# EAGLE design HelloWorldEAther (EAGLE 7.7.0)
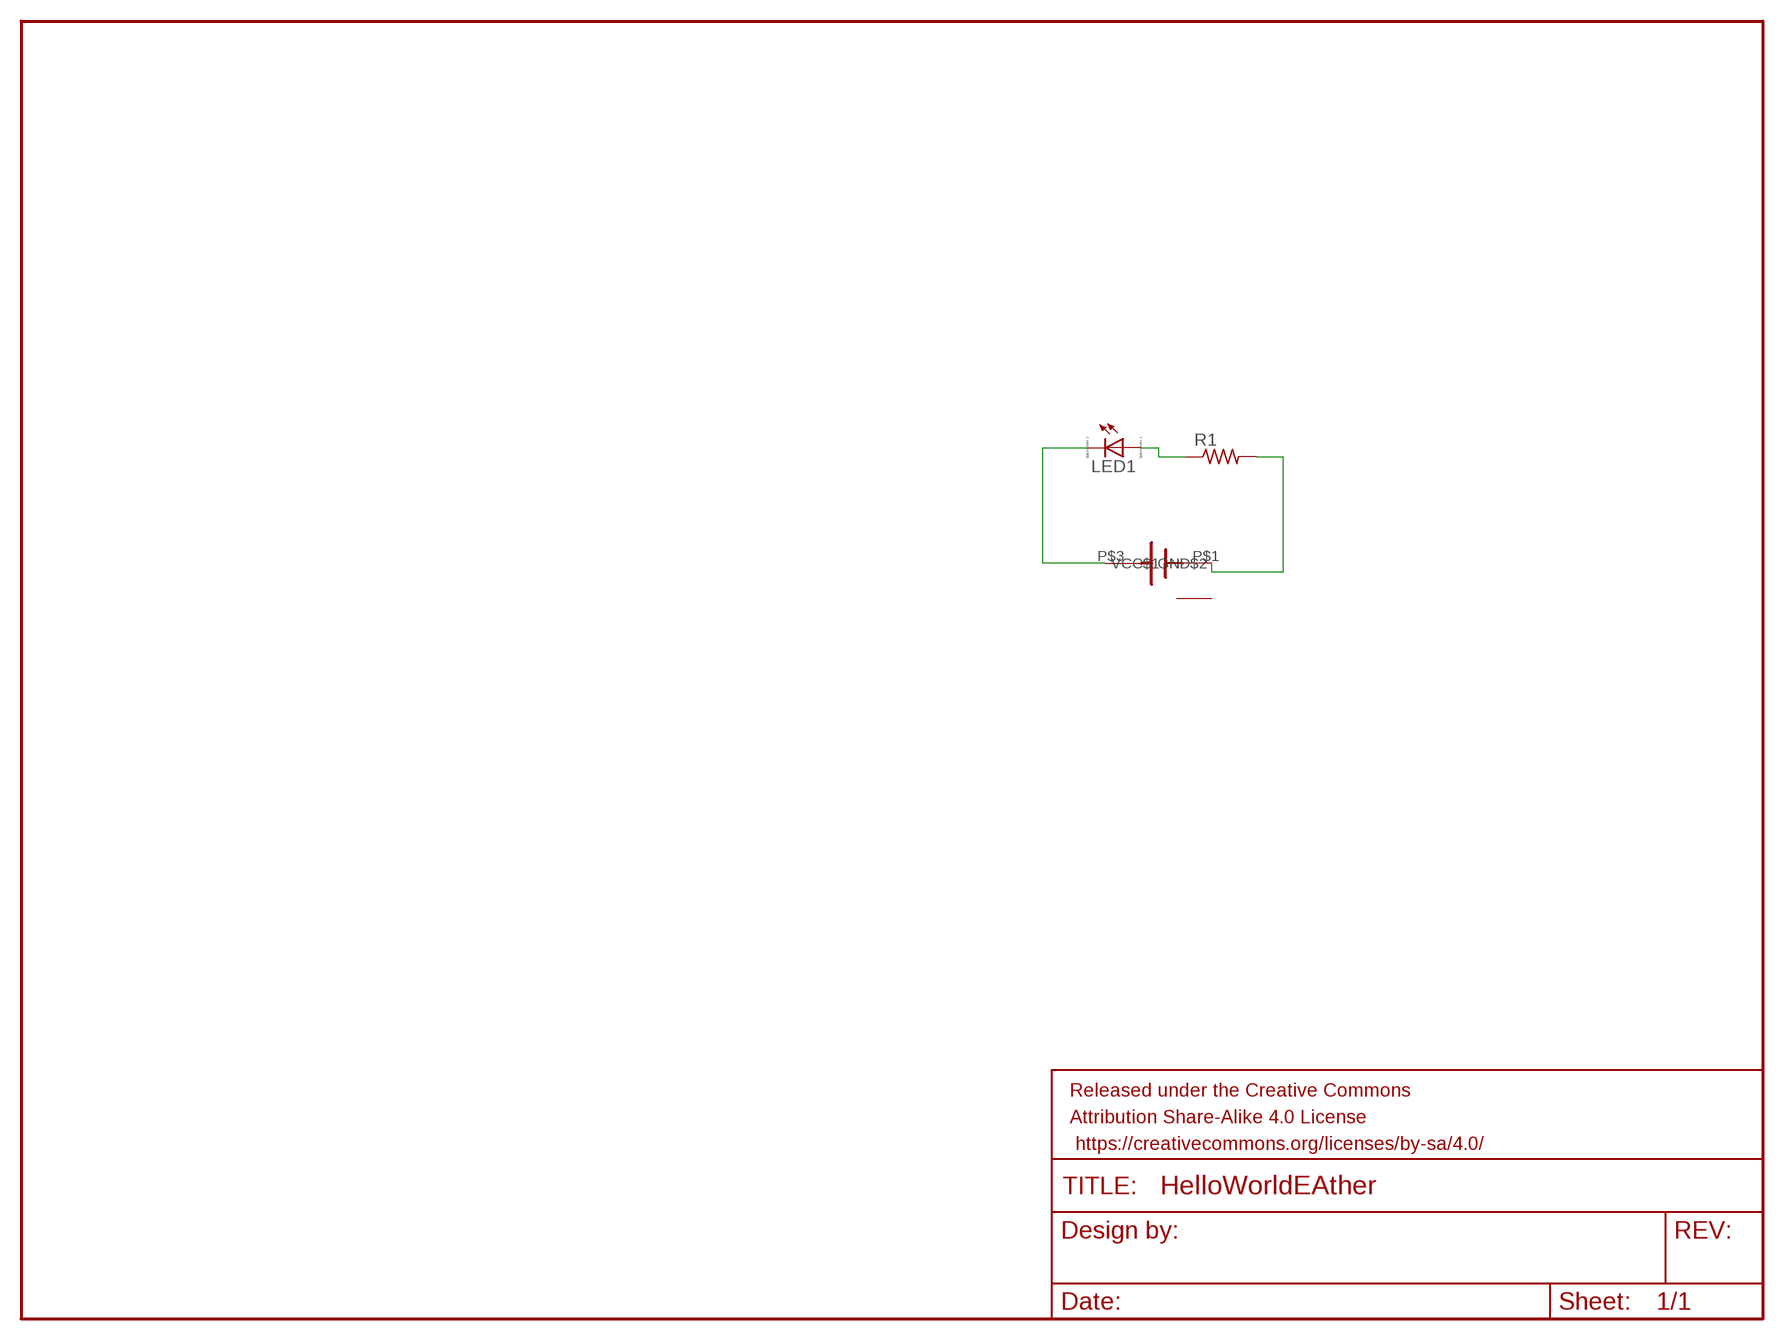
[diagram p0: schematic, sheet 1]

## Parts
FRAME1  FRAME-LETTER  [CREATIVE_COMMONS]
LED1  LED_E  [LED_1206]
R1  R-US_R0805  [R0805]
U$1  CR1025  [CR1025]

## Nets
BAT: R1.2 U$1.P$1(VCC$1)
LED: LED1.C U$1.P$3(GND$2)
R: LED1.A R1.1

## Power pins joined to a net without a drawn wire
VCC: U$1.P$2(VCC)

## Library data of the parts
FRAME1 = SparkFun-Aesthetics:FRAME-LETTER: Schematic Frame Standard 8.5x11 US Letter frame
LED1 = eagle-ltspice:LED_E: LED Source: http://www.osram.convergy.de Source: www.luxeon.com Source: www.kingbright.com; SPICEMODEL: NONE; SPICEPREFIX: D; SPICETYPE: diode
R1 = adafruit:R-US_: RESISTOR, American symbol
U$1 = battery:CR1025

## Board
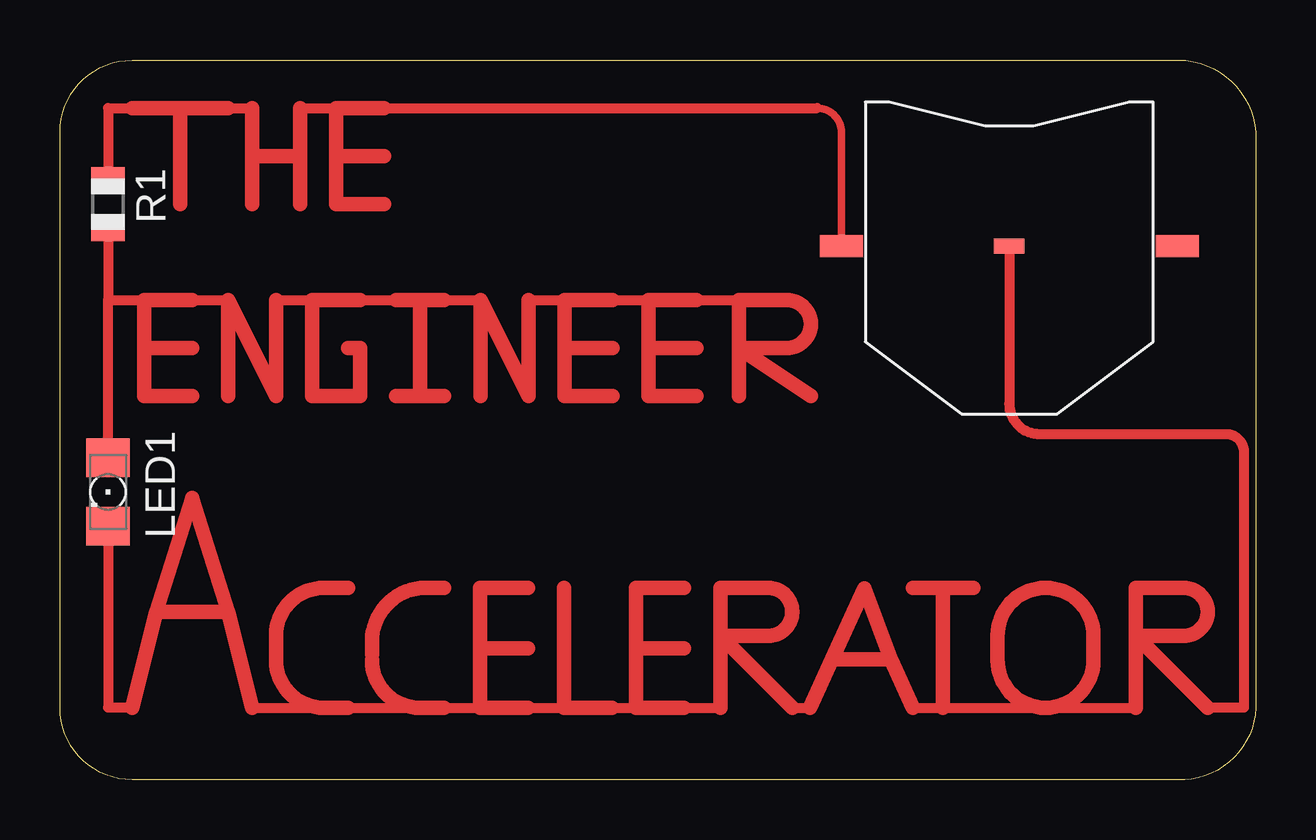
[diagram p1: board, top side]

Size 49.84 x 30.01 mm. Coordinates in mm from the lower left corner, seen from the top.
Outline: 0,27 arc-90 3,30 46.33,30 arc-90 49.84,27 49.84,3 arc-90 46.59,0 3,0 arc-90 0,3 0,27
Copper layers (1*16): Top 0.035mm / dielectric 1.5mm / Bottom 0.035mm
Design rules "default": minimum track width 10mil, minimum drill 24mil, track to track 8mil, track to pad 8mil, pad to pad 8mil, via to via 8mil, smd to smd 8mil, copper to edge 40mil, drill to drill 8mil, minimum pad ring 10mil, minimum via ring 8mil, stop-mask expansion 4mil, vias tented up to drill 0mil, thermal gap 10mil

### Footprints (pad centres in the part's own frame; a part is rotated, then mirrored left to right if it is on the bottom)
LED_1206 = smd 1.6 x 1.803: A -1.422,0; C 1.422,0
R0805 = smd 1.1 x 1.4: 1 -1,0; 2 1,0
CR1025 = smd 1.778 x 0.914: P$1 -7,0; P$2 7,0 | smd 1.27 x 0.635: P$3 0,0

### Placement (x,y rotation side)
FRAME1  -2,-9 0 top  (outside the outline)
LED1  2,12 270 top
R1  2,24 90 top
U$1  39.57,22.25 0 top

### Tracks (layer width: path | path; a pad name or v marks a point on that pad's centre or on a via)
BAT
  Top 0.305: U$1.P$1 32.57,27 arc90 31.57,28
  Top 0.406: 7,28 8,28 | 10,28 11.51,28 | 13.51,28 31.57,28 | R1.2 2,28 3,28
  Top 0.61: 5,28 3,28 | 5,24 5,28 | 5,28 7,28 | 8,28 8,26 | 8,24 8,26 | 8,26 10,26 | 10,26 10,24 | 10,26 10,28 | 13.51,26 11.51,26 | 11.51,26 11.51,24 13.51,24 | 11.51,26 11.51,28 13.51,28
LED
  Top 0.406: LED1.C 2,3 3,3 | 16,3 17.51,3 | 19.51,3 21.02,3 | 23.02,3 24.02,3 | 26.02,3 27.52,3 | 30.52,3 31.27,3 | 35.56,3 36.81,3 41.08,3 44.84,3 | 8,3 11,3 | 12,3 15,3 | 13,5.24 13,5 | U$1.P$3 39.57,15.67 arc90 40.83,14.41 48.6,14.41 arc-90 49.35,13.67 49.35,3 47.84,3
  Top 0.61: 4,7 5.51,11.75 7,7 | 16,8 15.24,8 arc90 13,5.76 | 16,3 15,3 arc-90 13,5 | 19.51,8 17.51,8 17.51,5.48 | 19.51,5.48 17.51,5.48 | 17.51,5.48 17.51,3 19.51,3 | 21.02,8 21.02,3 23.02,3 | 26.02,8 24.02,8 24.02,5.48 | 26.02,5.48 24.02,5.48 | 24.02,5.48 24.02,3 26.02,3 | 27.52,3 27.52,6 | 27.52,6 27.52,8 29.52,8 arc-90 30.52,7 arc-90 29.52,6 27.52,6 | 27.52,6 30.52,3 | 34.64,5.01 33.53,7.98 32.19,5.02 | 36.81,8 35.56,8 | 38.06,8 36.81,8 | 36.81,8 36.81,3 | 44.84,3 44.84,6 | 44.84,6 44.84,8 46.84,8 arc-90 47.84,7 arc-90 46.84,6 44.84,6 | 44.84,6 47.84,3 | 4,7 7,7 | 7,7 8,3 | 4,7 3,3 | 12,8 11,8 arc90 9,6 9,5 arc90 11,3 12,3 | 13,5.76 13,6 | 13,5.24 13,5.76 | 34.64,5.01 32.19,5.02 | 34.64,5.01 35.56,3 | 32.19,5.02 31.27,3 | 41.08,3 arc90 43.08,5 43.08,6 arc90 41.08,8 arc90 39.08,6 39.08,5 arc90 41.08,3
R
  Top 0.406: R1.1 2,20 | 5.51,20 7.02,20 | 9.02,20 10.51,20 | 12.51,20 14.02,20 | 16.02,20 17.52,20 | 19.52,20 21.03,20 | 23.03,20 24.54,20 | 26.54,20 28.3,20 | LED1.A 2,20 | 2,20 3.51,20
  Top 0.61: 5.51,18 3.51,18 | 3.51,18 3.51,16 5.51,16 | 3.51,18 3.51,20 5.51,20 | 7.02,16 7.02,20 9.02,16 9.02,20 | 12.02,18 12.51,18 12.51,16 10.51,16 10.51,20 12.51,20 | 14.02,20 15.02,20 | 15.02,16 14.02,16 | 16.02,16 15.02,16 | 15.02,16 15.02,20 | 15.02,20 16.02,20 | 17.52,16 17.52,20 19.52,16 19.52,20 | 23.03,18 21.03,18 | 21.03,18 21.03,16 23.03,16 | 21.03,18 21.03,20 23.03,20 | 26.54,18 24.54,18 | 24.54,18 24.54,16 26.54,16 | 24.54,18 24.54,20 26.54,20 | 28.3,18 30.3,18 arc90 31.3,19 arc90 30.3,20 28.3,20 28.3,18 | 28.3,16 28.3,18 | 28.3,18 31.3,16